# EAGLE design feather-load-tester (EAGLE 6.6.0)
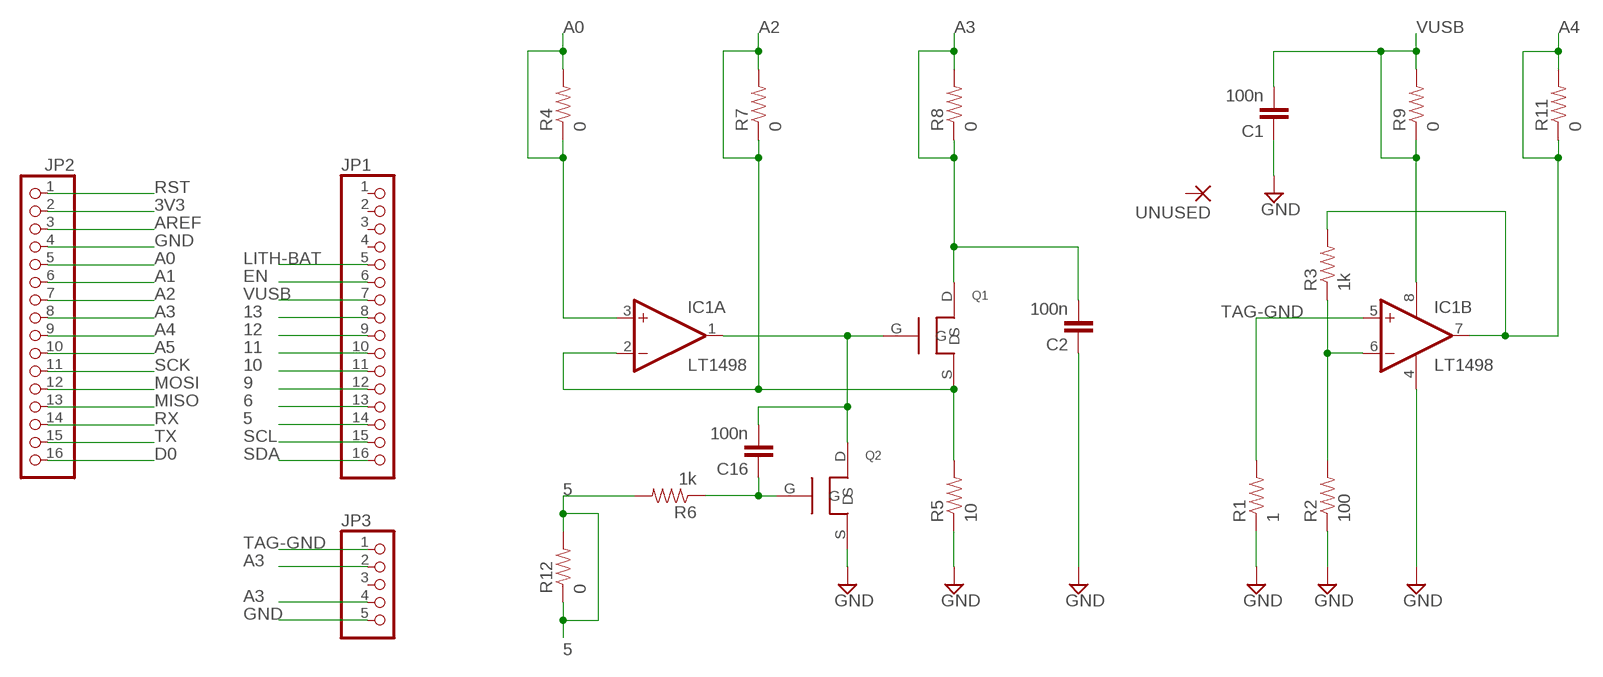
[diagram p0: schematic, sheet 1]

## Parts
C1  100n  0.33UF-50V-10%(0805)  [0805-CAP]
C2  100n  0.33UF-50V-10%(0805)  [0805-CAP]
C16  100n  0.33UF-50V-10%(0805)  [0805-CAP]
IC1  LT1498  2AMP_P8+4D  [SO08]
JP1  PINHD-1X16  [1X16]
JP2  PINHD-1X16  [1X16]
JP3  PINHD-1X5  [1X05]
Q1  NMOSFET_SC59  [SC59]
Q2  NMOSFET_SC59  [SC59]
R1  1  0.22OHM-1/4W-1%(0805)  [0805]
R2  100  0.22OHM-1/4W-1%(0805)  [0805]
R3  1k  0.22OHM-1/4W-1%(0805)  [0805]
R4  0  0.22OHM-1/4W-1%(0805)  [0805]
R5  10  0.22OHM-1/4W-1%(0805)  [0805]
R6  1k  0.22OHM-1/4W-1%(0805)  [0805]
R7  0  0.22OHM-1/4W-1%(0805)  [0805]
R8  0  0.22OHM-1/4W-1%(0805)  [0805]
R9  0  0.22OHM-1/4W-1%(0805)  [0805]
R11  0  0.22OHM-1/4W-1%(0805)  [0805]
R12  0  0.22OHM-1/4W-1%(0805)  [0805]
UNUSED  SMD2  [SMD1,27-2,54]

## Nets
3V3: JP2.2
5: JP1.14 R6.2 R12.1 R12.2
6: JP1.13
9: JP1.12
10: JP1.11
11: JP1.10
12: JP1.9
13: JP1.8
A0: IC1.3(A:+IN) JP2.5 R4.1 R4.2
A1: JP2.6
A2: IC1.2(A:-IN) JP2.7 Q1.S R5.2 R7.1 R7.2
A3: C2.2 JP2.8 JP3.2 JP3.4 Q1.D R8.1 R8.2
A4: IC1.7(B:OUT) JP2.9 R3.2 R11.1 R11.2
A5: JP2.10
AREF: JP2.3
D0: JP2.16
EN: JP1.6
GND: C1.1 C2.1 IC1.4(P:V-) JP2.4 JP3.5 Q2.S R1.1 R2.1 R5.1
LITH-BAT: JP1.5
MISO: JP2.13
MOSI: JP2.12
N$4: IC1.6(B:-IN) R2.2 R3.1
N$7: C16.1 Q2.G R6.1
N$9: C16.2 IC1.1(A:OUT) Q1.G Q2.D
RST: JP2.1
RX: JP2.14
SCK: JP2.11
SCL: JP1.15
SDA: JP1.16
TAG-GND: IC1.5(B:+IN) JP3.1 R1.2
TX: JP2.15
VUSB: C1.2 IC1.8(P:V+) JP1.7 R9.1 R9.2
Unconnected: JP1.1 JP1.2 JP1.3 JP1.4 JP3.3 UNUSED.1(P)

## Library data of the parts
C1 C2 C16 = SparkFun-Capacitors:0.33UF-50V-10%(0805): CAP-08469; PROD_ID: CAP-08469; VALUE: 0.33uF
IC1 = linear:2AMP_P8+4: OP AMP
JP1 JP2 = pinhead:PINHD-1X16: PIN HEADER
JP3 = pinhead:PINHD-1X5: PIN HEADER
Q1 Q2 = sivan-new:NMOSFET_*; MANUFACTURER: Diodes Inc.; MPN: DMN1019UFDE-7
R1-R9 R11 R12 = SparkFun-Resistors:0.22OHM-1/4W-1%(0805): RES-09883; PROD_ID: RES-09883; VALUE: 0.22
UNUSED = wirepad:SMD2: SMD PAD

## Board
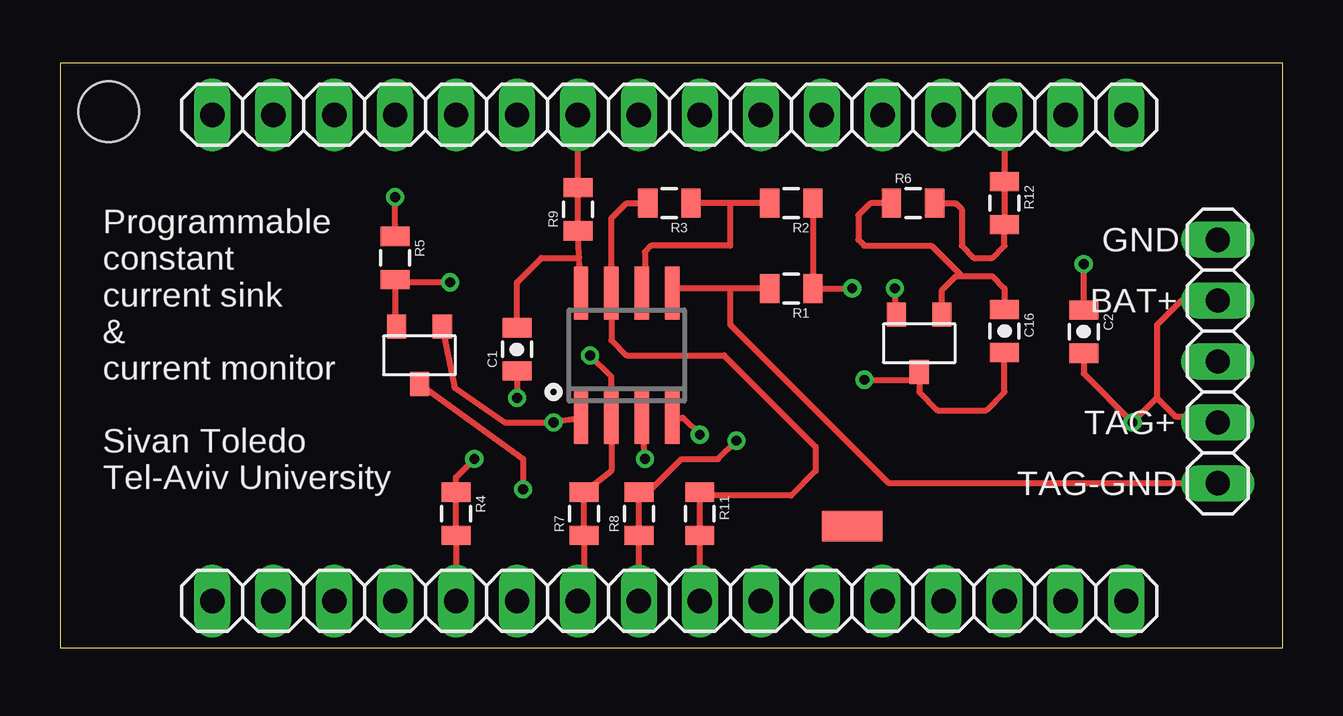
[diagram p1: board, top side]
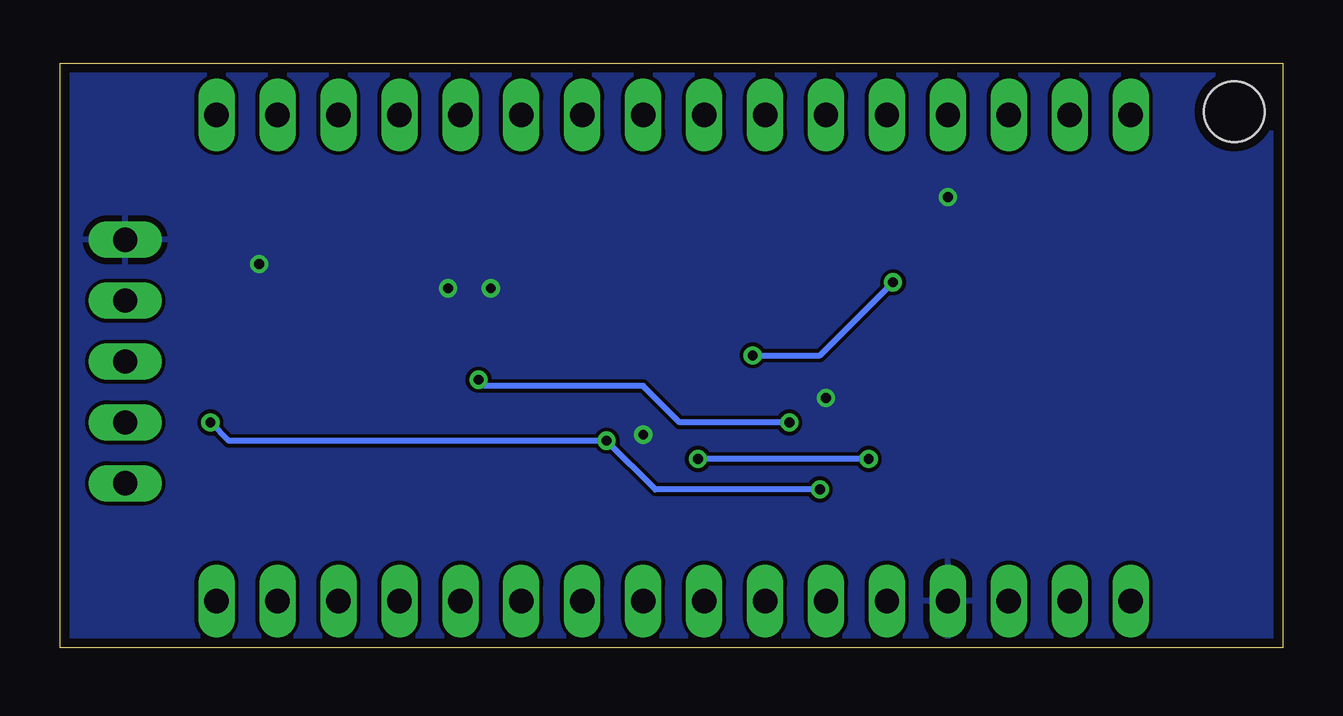
[diagram p2: board, bottom side, seen from below]

Size 50.98 x 24.37 mm. Coordinates in mm from the lower left corner, seen from the top.
Outline: 0,0 50.98,0 50.98,24.37 0,24.37 0,0
Copper layers (1*16): Top 0.0356mm / dielectric 1.5011mm / Bottom 0.0356mm
Design rules "oshpark-2layer": minimum track width 6mil, minimum drill 13mil, track to track 6mil, track to pad 6mil, pad to pad 6mil, via to via 6mil, smd to smd 6mil, copper to edge 15mil, drill to drill 6mil, minimum pad ring 7mil, minimum via ring 7mil, stop-mask expansion 2.5mil, vias tented up to drill 0mil, thermal gap 10mil
Holes 2.54 mm at 2.03,22.35

### Footprints (pad centres in the part's own frame; a part is rotated, then mirrored left to right if it is on the bottom)
0805-CAP = smd 0.8 x 1.2: 1 -0.9,0; 2 0.9,0
SO08 = smd 0.6 x 2.2: 1 -1.905,-2.6; 2 -0.635,-2.6; 3 0.635,-2.6; 4 1.905,-2.6; 5 1.905,2.6; 6 0.635,2.6; 7 -0.635,2.6; 8 -1.905,2.6
1X16 = drill 1.016 long: 1 -19.05,0; 2 -16.51,0; 3 -13.97,0; 4 -11.43,0; 5 -8.89,0; 6 -6.35,0; 7 -3.81,0; 8 -1.27,0; 9 1.27,0; 10 3.81,0; 11 6.35,0; 12 8.89,0; 13 11.43,0; 14 13.97,0; 15 16.51,0; 16 19.05,0
1X05 = drill 1.016 long: 1 -5.08,0; 2 -2.54,0; 3 0,0; 4 2.54,0; 5 5.08,0
SC59 = smd 0.8 x 1: D 0,1.2; G -0.95,-1.2; S 0.95,-1.2
0805 = smd 0.8 x 1.2: 1 -0.9,0; 2 0.9,0
SMD1,27-2,54 = smd 1.27 x 2.54: 1 0,0

### Placement (x,y rotation side)
C1  19.05,12.45 90 top
C2  42.67,13.18 270 top
C16  39.37,13.21 270 top
IC1  23.62,12.19 0 top
JP1  25.4,22.23 0 top
JP2  25.4,1.96 0 top
JP3  48.26,11.94 90 top
Q1  14.99,12.19 180 top
Q2  35.81,12.7 180 top
R1  30.48,14.99 180 top
R2  30.48,18.54 180 top
R3  25.4,18.54 180 top
R4  16.51,5.59 270 top
R5  13.97,16.26 270 top
R6  35.56,18.54 0 top
R7  21.84,5.59 90 top
R8  24.13,5.59 90 top
R9  21.59,18.29 90 top
R11  26.67,5.59 270 top
R12  39.37,18.54 270 top
UNUSED  33.02,5.08 90 top

### Tracks (layer width: path | path; a pad name or v marks a point on that pad's centre or on a via)
5
  Top 0.254: JP1.14 R12.1 R12.2 39.37,16.76 38.86,16.26 38.1,16.26 37.59,16.76 37.59,18.29 37.34,18.54 R6.2
A0  (via drill 0.41)
  Top 0.254: v17.27,7.87 16.51,7.11 R4.1 R4.2 JP2.5 | v24.38,7.87 IC1.3
  Bottom 0.254: v17.27,7.87 v24.38,7.87
A2  (via drill 0.41)
  Top 0.254: JP2.7 21.59,3.05 21.84,3.3 R7.1 R7.2 22.99,7.38 IC1.2 22.99,11.3 v22.1,12.19 | Q1.S 13.97,13.46 R5.2 14.09,15.24 v16.26,15.24
  Bottom 0.254: v22.1,12.19 19.3,12.19 v16.26,15.24
A3  (via drill 0.41)
  Top 0.254: Q1.D 19.3,7.87 v19.3,6.6 | JP2.8 R8.1 R8.2 24.13,6.6 24.64,6.6 25.91,7.87 27.43,7.87 v28.19,8.64 | JP3.4 46.74,14.48 45.72,13.46 45.72,10.41 | 45.72,10.41 46.48,9.65 48.01,9.65 JP3.2 | 45.72,10.41 v44.7,9.4 42.67,11.43 C2.2
  Bottom 0.254: v19.3,6.6 26.16,6.6 v28.19,8.64 43.94,8.64 v44.7,9.4
A4
  Top 0.254: R3.2 23.62,18.54 22.99,17.91 IC1.7 22.99,12.83 23.62,12.19 27.69,12.19 31.5,8.38 31.5,7.37 30.48,6.35 26.81,6.35 R11.1 R11.2 JP2.9
GND  (via drill 0.41)
  Top 0.254: R2.1 R1.1 v33.02,14.99 | IC1.4 25.97,9.59 v26.67,8.89 | Q2.S v34.8,14.99 | C2.1 v42.67,16 | R5.1 v13.97,18.8 | C1.1 v19.05,10.41
  Bottom 0.254: v26.67,8.89 26.67,9.14
  pour Bottom: -1.27,25.65 52.32,25.65 52.32,-0.76 -1.27,-0.76
N$4
  Top 0.254: IC1.6 24.38,14.92 24.38,16.51 24.64,16.76 27.94,16.76 27.94,18.54 | R2.2 27.94,18.54 | 27.94,18.54 R3.1
N$7
  Top 0.254: Q2.G 36.76,14.92 37.34,15.49 37.59,15.49 | 37.59,15.49 38.86,15.49 39.37,14.99 C16.1 | R6.1 33.78,18.54 33.27,18.03 33.27,17.02 33.53,16.76 36.32,16.76 37.59,15.49
N$9  (via drill 0.41)
  Top 0.254: Q1.G 16.44,10.86 18.54,9.4 v20.57,9.4 IC1.1 21.52,9.4 | C16.2 39.37,10.67 38.61,9.91 36.58,9.91 35.81,10.67 Q2.D 35.49,11.18 v33.53,11.18
  Bottom 0.254: v20.57,9.4 25.15,9.4 26.67,10.92 33.27,10.92 v33.53,11.18
TAG-GND
  Top 0.254: R1.2 27.94,14.99 | 27.94,14.99 25.53,14.99 IC1.5 | JP3.1 34.54,6.86 27.94,13.46 27.94,14.99
VUSB
  Top 0.254: IC1.8 21.64,16.28 | 21.64,16.28 R9.1 R9.2 JP1.7 | C1.2 19.05,15.24 20.07,16.26 21.62,16.26 21.64,16.28

### Text on the board
tNames: GND | BAT+ | TAG+ | Programmable / constant / current sink / & / current monitor / / Sivan Toledo / Tel-Aviv University | TAG-GND